# Altium schematic sheet CAN_MCU_LDO.SchDoc
size A; SheetNumber: 6; SheetTotal: 6
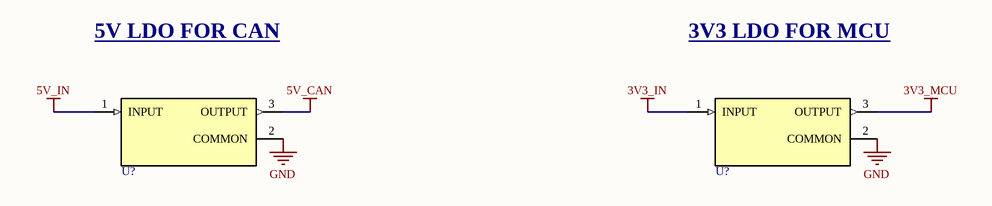
[diagram p0: CAN_MCU_LDO.SchDoc]

## Parts
(Parts that share a designator on the sheet are numbered #1, #2 ... from top to bottom, then left to right.)
U?#1  UA78M05IDCYR  [FP-DCY0004A-IPC_B]  (value not drawn)
U?#2  UA78M33CDCYR  [VREG_UA78M33CDCYR]  (value not drawn)

## Nets
3V3_IN: U?#2.1(INPUT)
3V3_MCU: U?#2.3(OUTPUT)
5V_CAN: U?#1.3(OUTPUT)
5V_IN: U?#1.1(INPUT)
GND: U?#1.2(COMMON) U?#2.2(COMMON)

## Notes on the sheet
- 5V LDO FOR CAN
- 3V3 LDO FOR MCU

## Library data of the parts
U?#1 = IC-LDO-0001: IC REG LINEAR 5V 500MA SOT223-4; Manufacturer: Texas Instruments; Min Supply Voltage: 7V; Number Of Outputs: 1; Dropout Voltage: 2V; Max Supply Voltage: 25V; Output Type: Fixed; Max Junction Temp: +125°C; Standoff Height: 0.02mm; Automotive: No; Temperature Range Low: -40°C; Temperature Range High: +125°C; Package: DCY0004A; Lead Free: Yes; Octopart: https://octopart.com/ua78m05idcyr-texas+instruments-525575; Output Current: 500mA; ComponentLink2URL: http://www.ti.com/lit/ds/symlink/ua78m.pdf; Mouser Description: Linear Voltage Regulators 5V 500mA Fixed Pos Voltage Regulator; Device Class L1: Integrated Circuits (ICs); Device Class L3: Voltage Regulators - Linear; RoHS: TRUE; ComponentLink2Description: Datasheet; Output Voltage: 5V; Height: 1.8mm; Temperature: -40°C to +125°C; Manufacturer Part Number: UA78M05IDCYR; Digikey Description: IC REG LINEAR 5V 500MA SOT223-4; Category: IC; Device Class L2: Power Management ICs; Ipc Land Pattern Name: SOT230P700X180-4
U?#2 = IC-LDO-0002: IC REG LIN 3.3V 500MA SOT223-4; MF: Texas Instruments; Purchase-URL: https://pricing.snapeda.com/search/part/UA78M33CDCYR/?ref=eda; Package: SOT-223-4 Texas Instruments; Value: *; Check_prices: https://www.snapeda.com/parts/UA78M33CDCYR/Texas+Instruments/view-part/?ref=eda; SnapEDA_Link: https://www.snapeda.com/parts/UA78M33CDCYR/Texas+Instruments/view-part/?ref=snap; Availability: In Stock; Price: None; MP: UA78M33CDCYR